# EAGLE design buck-regulator (EAGLE 9.5.1)
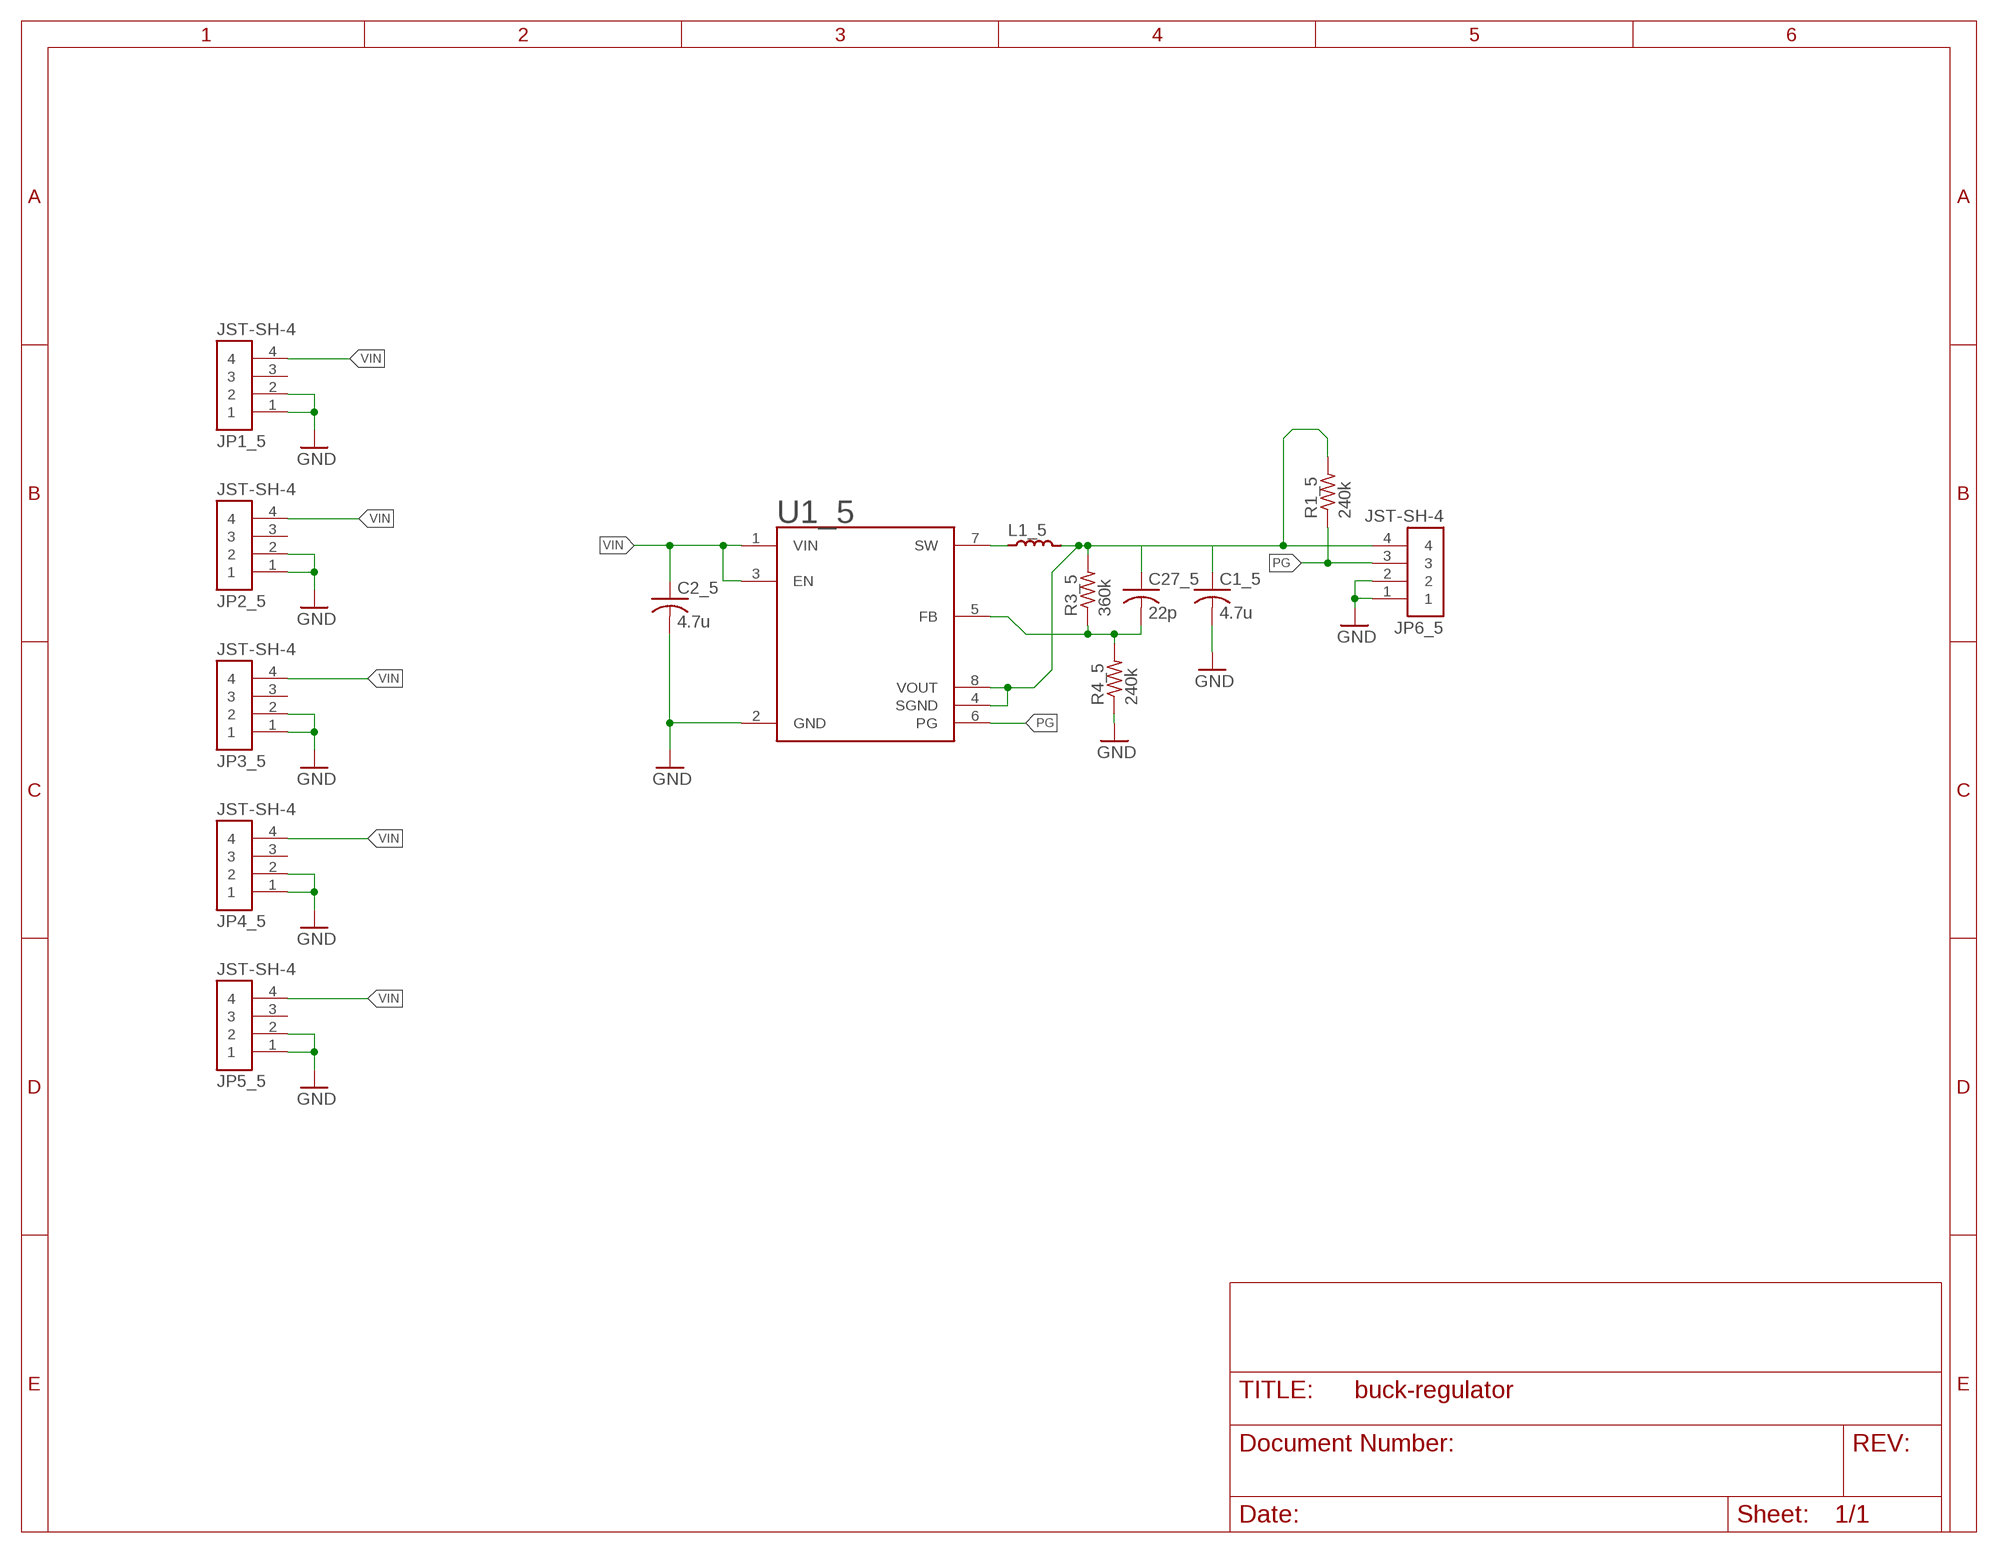
[diagram p0: schematic, sheet 1]

## Parts
C1_5  4.7u  C-USC0603  [C0603]
C2_5  4.7u  C-USC0603  [C0603]
C27_5  22p  C-USC0402  [C0402]
JP1_5  JST-SH-4  [JST-SH-4]
JP2_5  JST-SH-4  [JST-SH-4]
JP3_5  JST-SH-4  [JST-SH-4]
JP4_5  JST-SH-4  [JST-SH-4]
JP5_5  JST-SH-4  [JST-SH-4]
JP6_5  JST-SH-4  [JST-SH-4]
L1_5  22u  LQH3NPN220MMEL  [LQH3NPNXXXXMEX]
R1_5  240k  R-US_R0603  [R0603]
R3_5  360k  R-US_R0603  [R0603]
R4_5  240k  R-US_R0603  [R0603]
U1_5  TPS62120  [SOP65P280X145-8N]

## Nets
BUCK_OUT: C1_5.1 C27_5.1 JP6_5.4 L1_5.P$2 R1_5.2 R3_5.2 U1_5.4(SGND) U1_5.8(VOUT)
GND: C1_5.2 C2_5.2 JP1_5.1 JP1_5.2 JP2_5.1 JP2_5.2 JP3_5.1 JP3_5.2 JP4_5.1 JP4_5.2 JP5_5.1 JP5_5.2 JP6_5.1 JP6_5.2 R4_5.1 U1_5.2(GND)
N$4: C27_5.2 R3_5.1 R4_5.2 U1_5.5(FB)
N$5: L1_5.P$1 U1_5.7(SW)
PG: JP6_5.3 R1_5.1 U1_5.6(PG)
VIN: C2_5.1 JP1_5.4 JP2_5.4 JP3_5.4 JP4_5.4 JP5_5.4 U1_5.1(VIN) U1_5.3(EN)
Unconnected: JP1_5.3 JP2_5.3 JP3_5.3 JP4_5.3 JP5_5.3

## Library data of the parts
C1_5 C2_5 = rcl:C-US: CAPACITOR, American symbol; MFR: SAMSUNG; MFR_PN: CL10A475KA8NQNC; SPICEPREFIX: C
C27_5 = rcl:C-US: CAPACITOR, American symbol; MFR: KEMET; MFR_PN: C0603C220J5GACTU; SPICEPREFIX: C
JP1_5 JP2_5 JP3_5 JP4_5 JP5_5 JP6_5 = jst-sh:JST-SH-4: JST-SH 4 pin connector; MFR: JST; MFR_PN: SM04B-SRSS-TB(LF)(SN)
L1_5 = afig-0007:LQH3NPN220MMEL; MFR: MURATA; MFR_PN: LQH3NPN220MJRL
R1_5 R4_5 = rcl:R-US_: RESISTOR, American symbol; MFR: PANASONIC; MFR_PN: ERJ-3GEYJ244V; SPICEPREFIX: R
R3_5 = rcl:R-US_: RESISTOR, American symbol; MFR: PANASONIC; MFR_PN: ERJ-3GEYJ364V; SPICEPREFIX: R
U1_5 = afig-0007:TPS62120; MFR: TI; MFR_PN: TPS62120

## Board
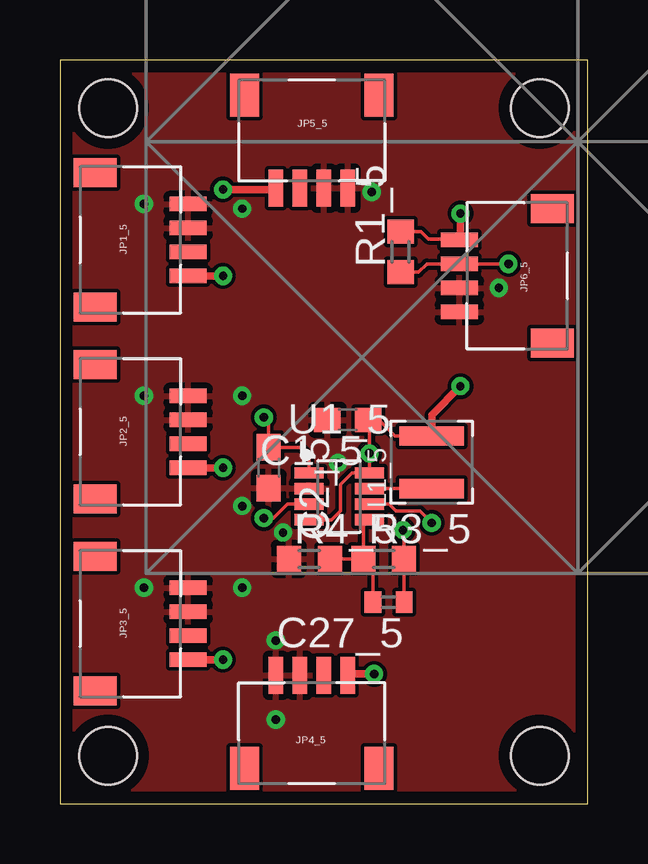
[diagram p1: board, top side]
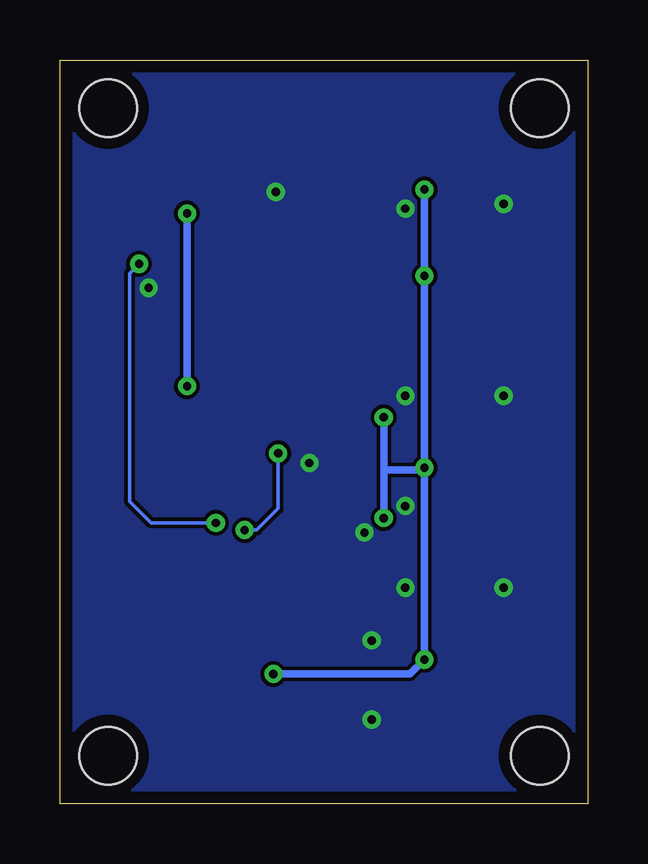
[diagram p2: board, bottom side, seen from below]

Size 22 x 31 mm. Coordinates in mm from the lower left corner, seen from the top.
Outline: 0,0 22,0 22,31 0,31 0,0
Copper layers (1*16): Top 0.035mm / dielectric 1.5mm / Bottom 0.035mm
Design rules "default *": minimum track width 6mil, minimum drill 0.35mm, track to track 6mil, track to pad 6mil, pad to pad 6mil, via to via 6mil, smd to smd 6mil, copper to edge 20mil, drill to drill 6mil, minimum pad ring 10mil, minimum via ring 8mil, stop-mask expansion 4mil, vias tented up to drill 15mil, thermal gap 10mil
Holes 2.4 mm at 20,2 2,2 2,29 20,29

### Footprints (pad centres in the part's own frame; a part is rotated, then mirrored left to right if it is on the bottom)
C0603 = smd 1.1 x 1: 1 -0.85,0; 2 0.85,0
C0402 = smd 0.7 x 0.9: 1 -0.65,0; 2 0.65,0
JST-SH-4 = smd 0.6 x 1.55: 1 -1.5,2.34; 2 -0.5,2.34; 3 0.5,2.34; 4 1.5,2.34 | smd 1.2 x 1.8: P-MOUNT1 -2.8,-1.535; P-MOUNT2 2.8,-1.535
LQH3NPNXXXXMEX = smd 0.8 x 2.7: P$1 -1.1,0; P$2 1.1,0
R0603 = smd 1 x 1.1: 1 -0.85,0; 2 0.85,0
SOP65P280X145-8N = smd 1.209 x 0.475: 1 -1.253,0.975; 2 -1.253,0.325; 3 -1.253,-0.325; 4 -1.253,-0.975; 5 1.253,-0.975; 6 1.253,-0.325; 7 1.253,0.325; 8 1.253,0.975

### Placement (x,y rotation side)
C1_5  12,16 180 top
C2_5  8.7,14 270 top
C27_5  13.7,8.4 180 top
JP1_5  3,23.5 270 top
JP2_5  3,15.5 270 top
JP3_5  3,7.5 270 top
JP4_5  10.5,3 0 top
JP5_5  10.5,28 180 top
JP6_5  19,22 90 top
L1_5  15.5,14.23 90 top
R1_5  14.2,23 90 top
R3_5  13.5,10.2 0 top
R4_5  10.4,10.2 0 top
U1_5  11.64,12.8 0 top

### Tracks (layer width: path | path; a pad name or v marks a point on that pad's centre or on a via)
BUCK_OUT  (via drill 0.35)
  Top 0.152: U1_5.4 11.33,11.83 11.7,12.2 11.7,13.3 12.18,13.78 U1_5.8 v12.9,14.6 | C27_5.1 R3_5.2 14.35,11.35 v14.3,11.4 | v12.9,14.6 | L1_5.P$2 13.97,15.33 13.3,16 C1_5.1 12.9,15.95 v12.9,14.6 | R1_5.2 15.05,23.85 15.36,23.54 16.7,23.54
  Top 0.305: L1_5.P$2 15.5,16.2 v16.7,17.4 | v16.7,24.6 16.7,23.54 JP6_5.4
  Bottom 0.152: v14.3,11.4 13.8,11.4 12.9,12.3 v12.9,14.6
  Bottom 0.305: v16.7,17.4 v16.7,24.6
GND  (via drill 0.35)
  other vias: 11.6,14.2 7.6,12.4 9.3,11.3 13,25.5 3.5,25 3.5,17 3.5,9 9,3.5 9,6.8 7.6,9 7.6,17 7.6,24.8 18.3,21.5
  pour Top: 0,-2 24,-2 24,32 0,32
  pour Bottom: 0,-2 24,-2 24,32 0,32
N$4
  Top 0.152: R3_5.1 12.65,11.58 U1_5.5 | C27_5.2 13.05,9.8 R3_5.1 | R4_5.2 R3_5.1
N$5
  Top 0.152: L1_5.P$1 U1_5.7
PG  (via drill 0.35)
  Top 0.152: U1_5.6 13.72,12.48 14,12.2 15,12.2 v15.5,11.7 | v18.7,22.5 JP6_5.3 15.3,22.5 14.95,22.15 R1_5.1
  Bottom 0.152: v15.5,11.7 18.2,11.7 19.1,12.6 19.1,22.1 v18.7,22.5
VIN  (via drill 0.35)
  Top 0.152: U1_5.1 10.39,14.51 10.05,14.85 C2_5.1 8.7,15.9 v8.5,16.1 | U1_5.3 9.48,12.48 8.9,11.9 v8.5,11.9
  Top 0.305: JP3_5.4 v6.8,6 | v6.8,25.6 8.94,25.6 JP5_5.4 | JP1_5.4 v6.8,22 | JP2_5.4 v6.8,14 | JP4_5.4 12.06,5.4 v13.1,5.4
  Bottom 0.305: v8.5,11.9 8.5,13.9 | 8.5,13.9 v8.5,16.1 | v6.8,14 v6.8,6 7.4,5.4 v13.1,5.4 | v6.8,14 v6.8,22 v6.8,25.6 | v6.8,14 6.9,13.9 8.5,13.9

### Text on the board
tDocu: optional / power reg